# Altium project Kayan22v1.0.PrjPcb
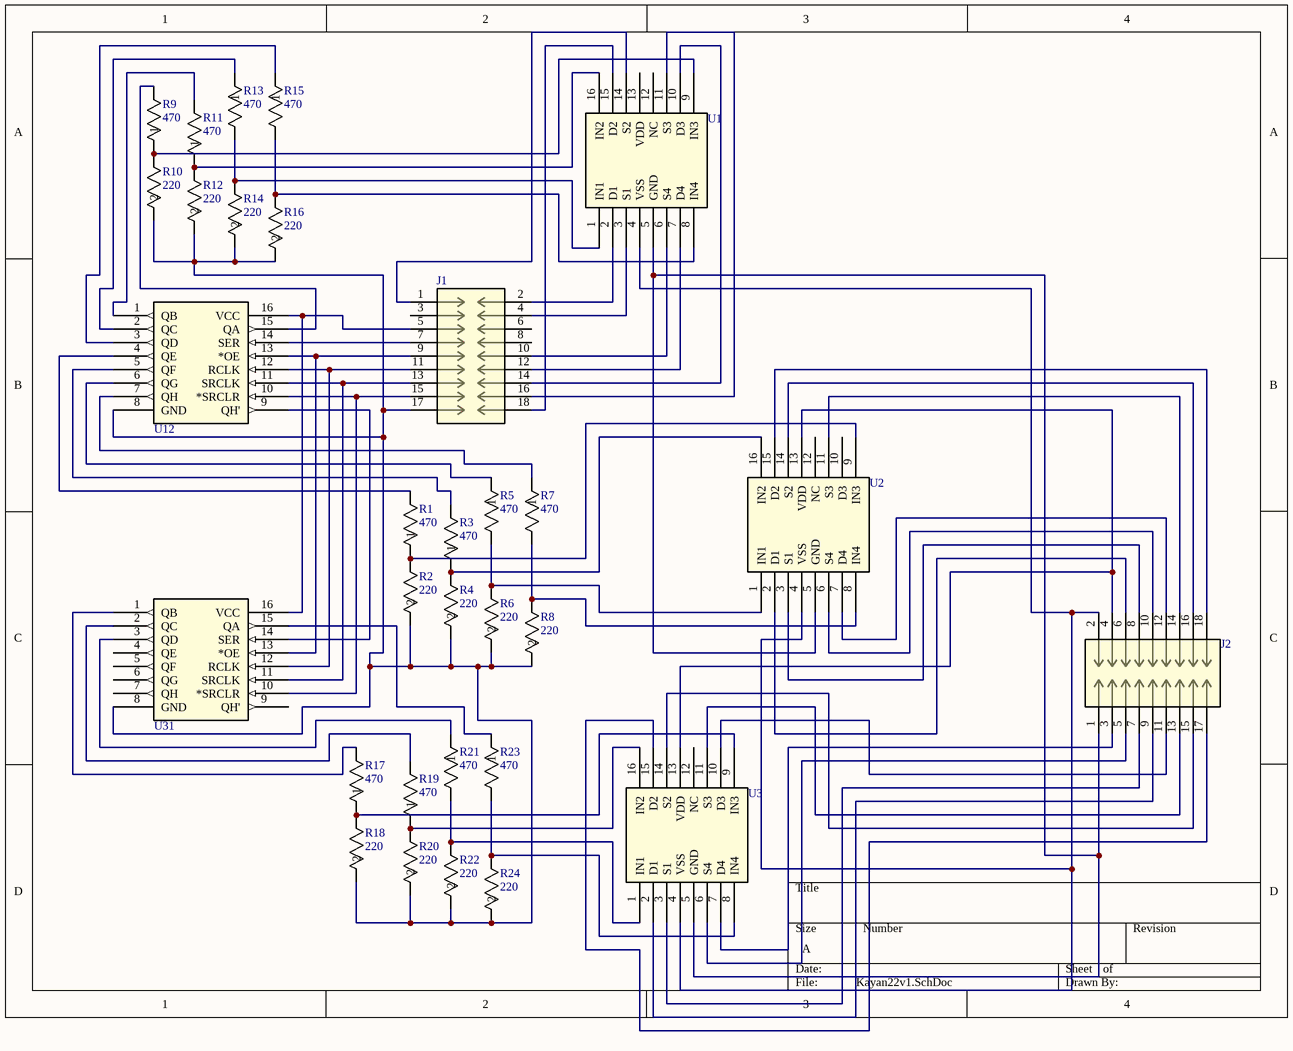
[diagram p0: Kayan22v1.SchDoc]
1 sheet, 31 parts. Net scope: global (net labels, ports and power ports of the same name join across sheets).
Board file: Kayan22v1.PcbDoc

## Sheet Kayan22v1.SchDoc
size A; SheetNumber: 1; SheetTotal: 1

### Parts
J1  68602-116HLF  [CONN_68602-116HLF_AMP]  (value not drawn)
J2  68602-116HLF  [CONN_68602-116HLF_AMP]  (value not drawn)
R1  470  [RES_ERA6V,6K_PAN]
R2  220  [RC0805N_PAN]
R3  470  [RES_ERA6V,6K_PAN]
R4  220  [RC0805N_PAN]
R5  470  [RES_ERA6V,6K_PAN]
R6  220  [RC0805N_PAN]
R7  470  [RES_ERA6V,6K_PAN]
R8  220  [RC0805N_PAN]
R9  470  [RES_ERA6V,6K_PAN]
R10  220  [RC0805N_PAN]
R11  470  [RES_ERA6V,6K_PAN]
R12  220  [RC0805N_PAN]
R13  470  [RES_ERA6V,6K_PAN]
R14  220  [RC0805N_PAN]
R15  470  [RES_ERA6V,6K_PAN]
R16  220  [RC0805N_PAN]
R17  470  [RES_ERA6V,6K_PAN]
R18  220  [RC0805N_PAN]
R19  470  [RES_ERA6V,6K_PAN]
R20  220  [RC0805N_PAN]
R21  470  [RES_ERA6V,6K_PAN]
R22  220  [RC0805N_PAN]
R23  470  [RES_ERA6V,6K_PAN]
R24  220  [RC0805N_PAN]
U1  ADG1412YRUZ-REEL7  [RU_16_ADI]  (value not drawn)
U2  ADG1412YRUZ-REEL7  [RU_16_ADI]  (value not drawn)
U3  ADG1412YRUZ-REEL7  [RU_16_ADI]  (value not drawn)
U12  SN74HC595DWR  [DW16]  (value not drawn)
U31  SN74HC595DWR  [DW16]  (value not drawn)

### Nets
NetJ1_1: J1.1 U1.14(S2)
NetJ1_2: J1.2 U1.2(D1)
NetJ1_4: J1.4 U1.3(S1)
NetJ1_5: J1.5 U12.16(VCC) U31.16(VCC)
NetJ1_7: J1.7 U12.14(SER)
NetJ1_9: J1.9 U12.13(*OE) U31.13(*OE)
NetJ1_10: J1.10 U1.6(S4)
NetJ1_11: J1.11 U12.12(RCLK) U31.12(RCLK)
NetJ1_12: J1.12 U1.7(D4)
NetJ1_13: J1.13 U12.11(SRCLK) U31.11(SRCLK)
NetJ1_14: J1.14 U1.10(D3)
NetJ1_15: J1.15 U12.10(*SRCLR) U31.10(*SRCLR)
NetJ1_16: J1.16 U1.11(S3)
NetJ1_17: J1.17 R2.2 R4.2 R6.2 R8.2 R10.2 R12.2 R14.2 R16.2 R18.2 R20.2 R22.2 R24.2 U12.8(GND) U31.8(GND)
NetJ1_18: J1.18 U1.15(D2)
NetJ2_1: J2.1 U1.5(GND) U2.5(GND) U3.5(GND)
NetJ2_2: J2.2 U1.4(VSS) U2.4(VSS) U3.4(VSS)
NetJ2_3: J2.3 U3.7(D4)
NetJ2_4: J2.4 U2.13(VDD) U3.13(VDD)
NetJ2_5: J2.5 U3.6(S4)
NetJ2_6: J2.6 U2.2(D1)
NetJ2_7: J2.7 U3.3(S1)
NetJ2_8: J2.8 U2.3(S1)
NetJ2_9: J2.9 U3.2(D1)
NetJ2_10: J2.10 U2.6(S4)
NetJ2_11: J2.11 U3.10(D3)
NetJ2_12: J2.12 U2.7(D4)
NetJ2_13: J2.13 U3.11(S3)
NetJ2_14: J2.14 U2.11(S3)
NetJ2_15: J2.15 U3.14(S2)
NetJ2_16: J2.16 U2.14(S2)
NetJ2_17: J2.17 U3.15(D2)
NetJ2_18: J2.18 U2.15(D2)
NetR1_1: R1.1 R2.1 U2.9(IN3)
NetR1_2: R1.2 U12.4(QE)
NetR3_1: R3.1 R4.1 U2.16(IN2)
NetR3_2: R3.2 U12.5(QF)
NetR5_1: R5.1 U12.6(QG)
NetR5_2: R5.2 R6.1 U2.1(IN1)
NetR7_1: R7.1 U12.7(QH)
NetR7_2: R7.2 R8.1 U2.8(IN4)
NetR9_1: R9.1 R10.1 U1.9(IN3)
NetR9_2: R9.2 U12.15(QA)
NetR11_1: R11.1 R12.1 U1.16(IN2)
NetR11_2: R11.2 U12.1(QB)
NetR13_1: R13.1 U12.2(QC)
NetR13_2: R13.2 R14.1 U1.1(IN1)
NetR15_1: R15.1 U12.3(QD)
NetR15_2: R15.2 R16.1 U1.8(IN4)
NetR17_1: R17.1 R18.1 U3.9(IN3)
NetR17_2: R17.2 U31.1(QB)
NetR19_1: R19.1 R20.1 U3.16(IN2)
NetR19_2: R19.2 U31.2(QC)
NetR21_1: R21.1 U31.3(QD)
NetR21_2: R21.2 R22.1 U3.1(IN1)
NetR23_1: R23.1 U31.15(QA)
NetR23_2: R23.2 R24.1 U3.8(IN4)
NetU12_9: U12.9(QH') U31.14(SER)

Not connected (* = marked no-connect by the designer): J1 3 6 8; U1 12(NC) 13(VDD); U2 10(D3) 12(NC); U3 12(NC); U31 4(QE) 5(QF) 6(QG) 7(QH) 9(QH')

### Library data of the parts
J1 J2 = 68602-116HLF: No Description Available; Mfr_Name: Amphenol ICC; Copyright: Copyright (C) 2023 Ultra Librarian. All rights reserved.; Manufacturer_Part_Number: 68602-116HLF; Digi-Key_Part_Number_1: 609-3364-ND; RefDes: RefDes; Type: DEV
R1 R3 R5 R7 R9 R11 R13 R15 R17 R19 R21 R23 = ERA-6VEB4700V: No Description Available; Mfr_Name: Panasonic; Copyright: Copyright (C) 2023 Ultra Librarian. All rights reserved.; Manufacturer_Part_Number: ERA-6VEB4700V; Digi-Key_Part_Number_1: 10-ERA-6VEB4700VTR-ND; Digi-Key_Part_Number_2: 10-ERA-6VEB4700VCT-ND; Digi-Key_Part_Number_3: 10-ERA-6VEB4700VDKR-ND; RefDes: RefDes; Type: DEV
R2 R4 R6 R8 R10 R12 R14 R16 R18 R20 R22 R24 = ERA-6AEB221V: No Description Available; Mfr_Name: Panasonic; Copyright: Copyright (C) 2023 Ultra Librarian. All rights reserved.; Manufacturer_Part_Number: ERA-6AEB221V; RefDes: RefDes; Type: DEV
U1-U3 = ADG1412YRUZ-REEL7: No Description Available; Mfr_Name: Analog Devices Inc; Copyright: Copyright (C) 2023 Ultra Librarian. All rights reserved.; Manufacturer_Part_Number: ADG1412YRUZ-REEL7; Digi-Key_Part_Number_1: ADG1412YRUZ-REEL7CT-ND; Digi-Key_Part_Number_2: ADG1412YRUZ-REEL7DKR-ND; Digi-Key_Part_Number_3: ADG1412YRUZ-REEL7TR-ND; RefDes: RefDes; Type: DEV
U12 U31 = SN74HC595DWR: No Description Available; Mfr_Name: Texas Instruments; Copyright: Copyright (C) 2023 Ultra Librarian. All rights reserved.; Manufacturer_Part_Number: SN74HC595DWR; RefDes: RefDes; Type: DEV